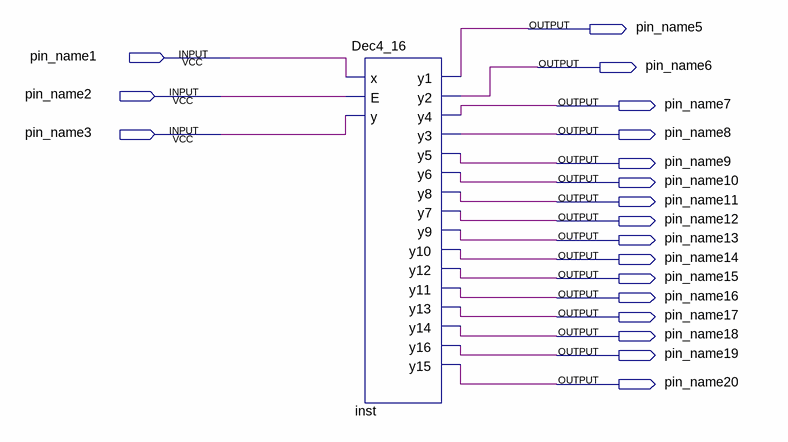
[diagram p0: schematic sheet]
// Quartus schematic DecoderDemo2.bdf as structural Verilog: 1 symbols, 19 pins
module DecoderDemo2 (
  input  pin_name1,
  input  pin_name2,
  input  pin_name3,
  output pin_name5,
  output pin_name6,
  output pin_name7,
  output pin_name8,
  output pin_name9,
  output pin_name10,
  output pin_name11,
  output pin_name12,
  output pin_name13,
  output pin_name14,
  output pin_name15,
  output pin_name16,
  output pin_name17,
  output pin_name18,
  output pin_name19,
  output pin_name20
);

  Dec4_16 inst (
    .x(pin_name1), .E(pin_name2), .y(pin_name3), .y1(pin_name5), .y2(pin_name6), .y4(pin_name7),
    .y3(pin_name8), .y5(pin_name9), .y6(pin_name10), .y8(pin_name11), .y7(pin_name12), .y9(pin_name13),
    .y10(pin_name14), .y12(pin_name15), .y11(pin_name16), .y13(pin_name17), .y14(pin_name18),
    .y16(pin_name19), .y15(pin_name20));
endmodule
